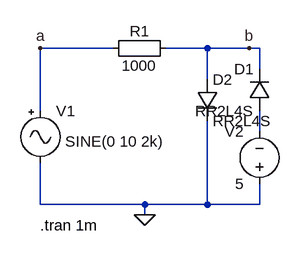
[diagram p0: schematic LD-REG-3.asc]
LD-REG-3.asc, the LTspice schematic file:
Version 4
SHEET 1 880 680
WIRE 0 96 -112 96
WIRE 144 96 80 96
WIRE 208 96 144 96
WIRE 224 96 208 96
WIRE 224 128 224 96
WIRE 144 144 144 96
WIRE -112 192 -112 96
WIRE 224 224 224 192
WIRE -112 336 -112 272
WIRE 48 336 -112 336
WIRE 144 336 144 208
WIRE 144 336 48 336
WIRE 224 336 224 304
WIRE 224 336 144 336
WIRE 48 352 48 336
FLAG -112 96 a
FLAG 208 96 b
FLAG 48 352 0
SYMBOL diode 240 192 R180
WINDOW 3 24 0 Left 2
WINDOW 0 24 64 Left 2
SYMATTR Value RR2L4S
SYMATTR InstName D1
SYMBOL Misc\\signal -112 176 R0
WINDOW 123 0 0 Left 2
WINDOW 39 0 0 Left 2
WINDOW 3 38 63 Left 2
SYMATTR Value SINE(0 10 2k)
SYMATTR InstName V1
SYMBOL Misc\\EuropeanResistor 96 80 R90
WINDOW 0 5 56 VBottom 2
WINDOW 3 27 56 VTop 2
SYMATTR InstName R1
SYMATTR Value 1000
SYMBOL voltage 224 320 R180
WINDOW 0 24 96 Left 2
WINDOW 3 24 16 Left 2
SYMATTR InstName V2
SYMATTR Value 5
SYMBOL diode 128 144 R0
SYMATTR Value RR2L4S
SYMATTR InstName D2
TEXT -112 368 Left 2 !.tran 1m

The netlist it stands for:
* LD-REG-3.asc
D1 N001 b RR2L4S
V1 a 0 SINE(0 10 2k)
R1 b a 1000
V2 0 N001 5
D2 b 0 RR2L4S
.model D D
.lib standard.dio
.tran 1m
.backanno
.end